# Altium schematic sheet ddc.schdoc: SoRad: Digital Down Converter
size C; Author: Chris Hiszpanski
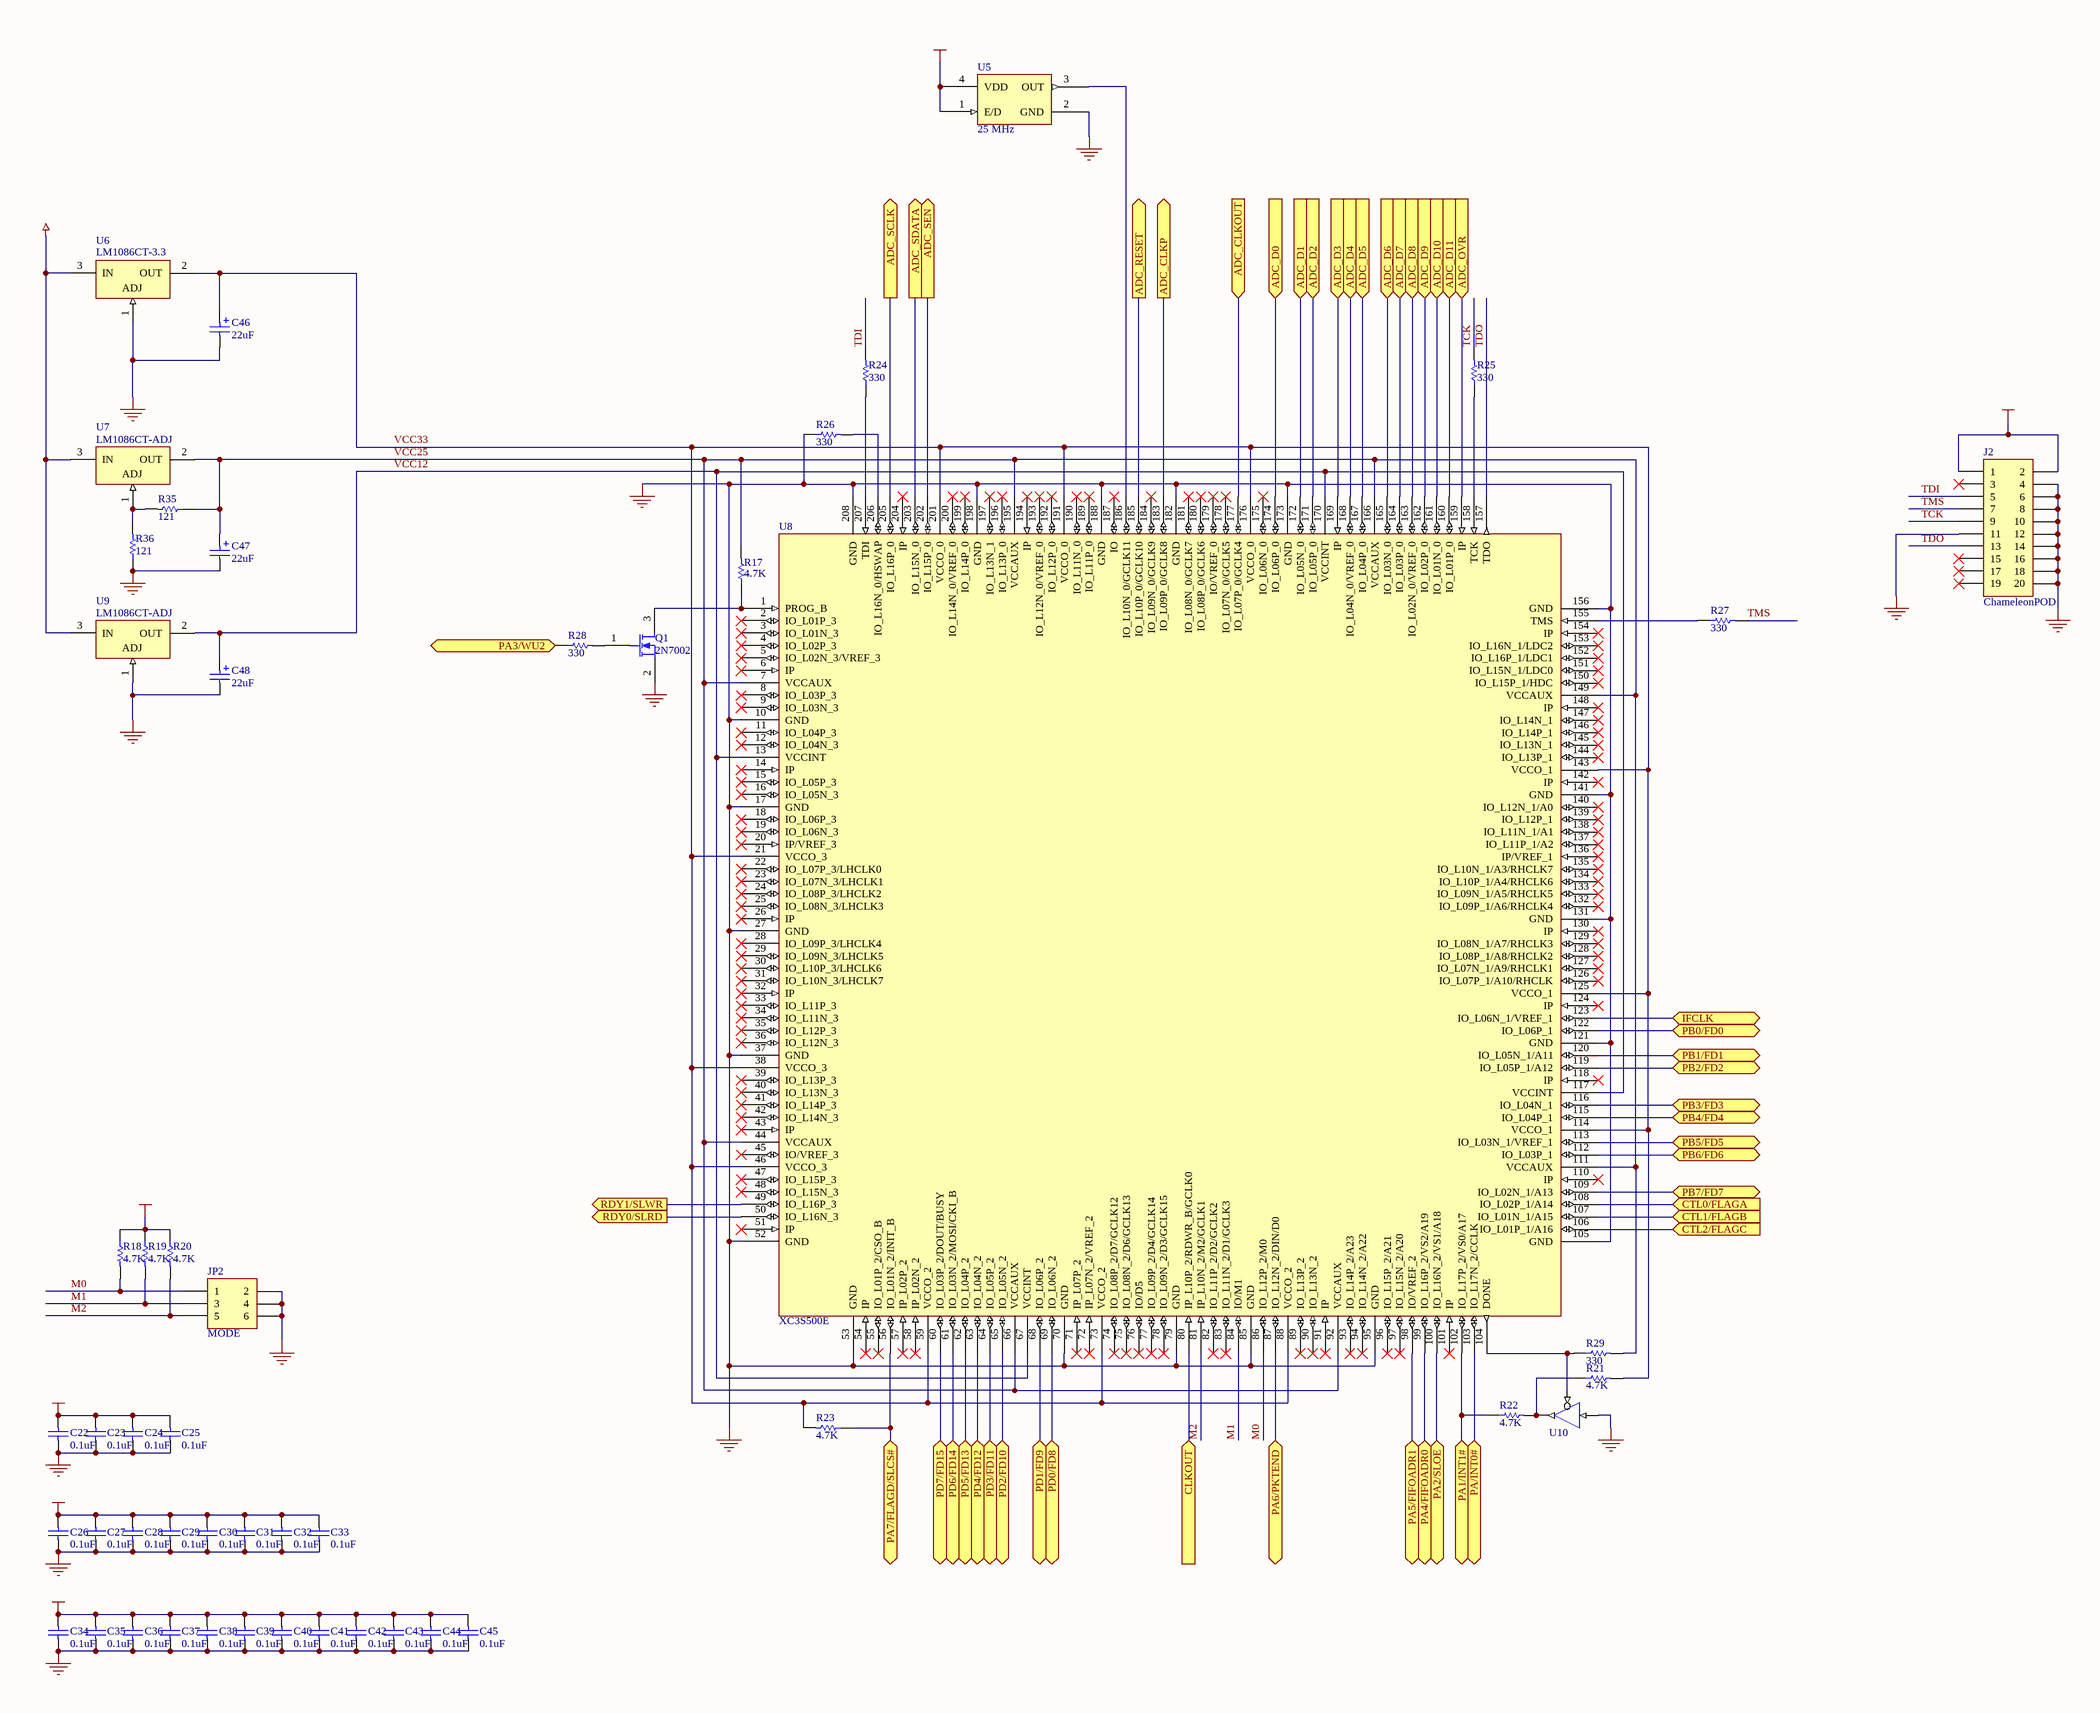
[diagram p0: ddc.schdoc]

## Parts
C22  0.1uF  [CC2012-0805]
C23  0.1uF  [CC2012-0805]
C24  0.1uF  [CC2012-0805]
C25  0.1uF  [CC2012-0805]
C26  0.1uF  [CC2012-0805]
C27  0.1uF  [CC2012-0805]
C28  0.1uF  [CC2012-0805]
C29  0.1uF  [CC2012-0805]
C30  0.1uF  [CC2012-0805]
C31  0.1uF  [CC2012-0805]
C32  0.1uF  [CC2012-0805]
C33  0.1uF  [CC2012-0805]
C34  0.1uF  [CC2012-0805]
C35  0.1uF  [CC2012-0805]
C36  0.1uF  [CC2012-0805]
C37  0.1uF  [CC2012-0805]
C38  0.1uF  [CC2012-0805]
C39  0.1uF  [CC2012-0805]
C40  0.1uF  [CC2012-0805]
C41  0.1uF  [CC2012-0805]
C42  0.1uF  [CC2012-0805]
C43  0.1uF  [CC2012-0805]
C44  0.1uF  [CC2012-0805]
C45  0.1uF  [CC2012-0805]
C46  22uF  [RB6.3]
C47  22uF  [RB6.3]
C48  22uF  [RB6.3]
J2  ChameleonPOD  [HDR2X10]
JP2  MODE  [HDR2X3]
Q1  2N7002  [SOT-23-3]
R17  4.7K  [CR2012-0805]
R18  4.7K  [CR2012-0805]
R19  4.7K  [CR2012-0805]
R20  4.7K  [CR2012-0805]
R21  4.7K  [CR2012-0805]
R22  4.7K  [CR2012-0805]
R23  4.7K  [CR2012-0805]
R24  330  [CR2012-0805]
R25  330  [CR2012-0805]
R26  330  [CR2012-0805]
R27  330  [CR2012-0805]
R28  330  [CR2012-0805]
R29  330  [CR2012-0805]
R35  121  [CC2012-0805]
R36  121  [CC2012-0805]
U5  25 MHz  [CSX750FB]
U6  LM1086CT-3.3  [SFM-T3/A4.7V]
U7  LM1086CT-ADJ  [SFM-T3/A4.7V]
U8  XC3S500E  [PQFP208]
U9  LM1086CT-ADJ  [SFM-T3/A4.7V]
U10  SN74AHC1G125  [SOT-23-6]  (value not drawn)

## Ports
ADC_CLKOUT (in), ADC_CLKP (out), ADC_D0 (in), ADC_D1 (in), ADC_D2 (in), ADC_D3 (in), ADC_D4 (in), ADC_D5 (in), ADC_D6 (in), ADC_D7 (in), ADC_D8 (in), ADC_D9 (in), ADC_D10 (in), ADC_D11 (in), ADC_OVR (in), ADC_RESET (out), ADC_SCLK (out), ADC_SDATA (out), ADC_SEN (out), CLKOUT (in), CTL0/FLAGA (in), CTL1/FLAGB (in), CTL2/FLAGC (in), IFCLK (bidir), PA1/INT1# (bidir), PA2/SLOE (bidir), PA3/WU2 (bidir), PA4/FIFOADR0 (bidir), PA5/FIFOADR1 (bidir), PA6/PKTEND (bidir), PA7/FLAGD/SLCS# (bidir), PA/INT0# (bidir), PB0/FD0 (bidir), PB1/FD1 (bidir), PB2/FD2 (bidir), PB3/FD3 (bidir), PB4/FD4 (bidir), PB5/FD5 (bidir), PB6/FD6 (bidir), PB7/FD7 (bidir), PD0/FD8 (bidir), PD1/FD9 (bidir), PD2/FD10 (bidir), PD3/FD11 (bidir), PD4/FD12 (bidir), PD5/FD13 (bidir), PD6/FD14 (bidir), PD7/FD15 (bidir), RDY0/SLRD (out), RDY1/SLWR (out)

## Nets
GND: C22.1 C23.1 C24.1 C25.1 C26.1 C27.1 C28.1 C29.1 C30.1 C31.1 C32.1 C33.1 C34.1 C35.1 C36.1 C37.1 C38.1 C39.1 C40.1 C41.1 C42.1 C43.1 C44.1 C45.1 C46.2 C47.2 C48.2 J2.4 J2.6 J2.8 J2.10 J2.11 J2.12 J2.14 J2.16 J2.18 J2.20 JP2.2 JP2.4 JP2.6 Q1.2(S) R26.1 R36.1 U5.2(GND) U6.1(ADJ) U8.10(GND) U8.17(GND) U8.27(GND) U8.37(GND) U8.52(GND) U8.53(GND) U8.70(GND) U8.79(GND) U8.85(GND) U8.95(GND) U8.105(GND) U8.121(GND) U8.131(GND) U8.141(GND) U8.156(GND) U8.173(GND) U8.182(GND) U8.188(GND) U8.198(GND) U8.208(GND) U9.1(ADJ) U10.2(A) U10.3(GND)
VCC5: U6.3(IN) U7.3(IN) U9.3(IN)
VCC12: C22.2 C23.2 C24.2 C25.2 C48.1 U8.13(VCCINT) U8.67(VCCINT) U8.117(VCCINT) U8.170(VCCINT) U9.2(OUT)
VCC25: C26.2 C27.2 C28.2 C29.2 C30.2 C31.2 C32.2 C33.2 C47.1 R17.2 R29.2 R35.1 U7.2(OUT) U8.7(VCCAUX) U8.44(VCCAUX) U8.66(VCCAUX) U8.92(VCCAUX) U8.111(VCCAUX) U8.149(VCCAUX) U8.166(VCCAUX) U8.195(VCCAUX)
VCC33: C34.2 C35.2 C36.2 C37.2 C38.2 C39.2 C40.2 C41.2 C42.2 C43.2 C44.2 C45.2 C46.1 J2.1 J2.2 R18.1 R19.1 R20.1 R21.2 R23.2 U5.1(E/D) U5.4(VDD) U6.2(OUT) U8.21(VCCO_3) U8.38(VCCO_3) U8.46(VCCO_3) U8.59(VCCO_2) U8.73(VCCO_2) U8.88(VCCO_2) U8.114(VCCO_1) U8.125(VCCO_1) U8.143(VCCO_1) U8.176(VCCO_0) U8.191(VCCO_0) U8.201(VCCO_0) U10.5(VCC)
ADC_CLKOUT: U8.177(IO_L07P_0/GCLK4) ; port ADC_CLKOUT
ADC_CLKP: U8.183(IO_L09P_0/GCLK8) ; port ADC_CLKP
ADC_D0: U8.174(IO_L06P_0) ; port ADC_D0
ADC_D1: U8.172(IO_L05N_0) ; port ADC_D1
ADC_D2: U8.171(IO_L05P_0) ; port ADC_D2
ADC_D3: U8.169(IP) ; port ADC_D3
ADC_D4: U8.168(IO_L04N_0/VREF_0) ; port ADC_D4
ADC_D5: U8.167(IO_L04P_0) ; port ADC_D5
ADC_D6: U8.165(IO_L03N_0) ; port ADC_D6
ADC_D7: U8.164(IO_L03P_0) ; port ADC_D7
ADC_D8: U8.163(IO_L02N_0/VREF_0) ; port ADC_D8
ADC_D9: U8.162(IO_L02P_0) ; port ADC_D9
ADC_D10: U8.161(IO_L01N_0) ; port ADC_D10
ADC_D11: U8.160(IO_L01P_0) ; port ADC_D11
ADC_OVR: U8.159(IP) ; port ADC_OVR
ADC_RESET: U8.185(IO_L10P_0/GCLK10) ; port ADC_RESET
ADC_SCLK: U8.205(IO_L16P_0) ; port ADC_SCLK
ADC_SDATA: U8.203(IO_L15N_0) ; port ADC_SDATA
ADC_SEN: U8.202(IO_L15P_0) ; port ADC_SEN
CLKOUT: U8.80(IP_L10P_2/RDWR_B/GCLK0) ; port CLKOUT
CTL0/FLAGA: U8.108(IO_L02P_1/A14) ; port CTL0/FLAGA
CTL1/FLAGB: U8.107(IO_L01N_1/A15) ; port CTL1/FLAGB
CTL2/FLAGC: U8.106(IO_L01P_1/A16) ; port CTL2/FLAGC
IFCLK: U8.123(IO_L06N_1/VREF_1) ; port IFCLK
M0: JP2.1 R18.2 U8.86(IO_L12P_2/M0)
M1: JP2.3 R19.2 U8.84(IO/M1)
M2: JP2.5 R20.2 U8.81(IP_L10N_2/M2/GCLK1)
PA1/INT1#: R22.1 U8.102(IO_L17P_2/VS0/A17) ; port PA1/INT1#
PA2/SLOE: U8.100(IO_L16N_2/VS1/A18) ; port PA2/SLOE
PA3/WU2: R28.1 ; port PA3/WU2
PA4/FIFOADR0: U8.99(IO_L16P_2/VS2/A19) ; port PA4/FIFOADR0
PA5/FIFOADR1: U8.98(IO/VREF_2) ; port PA5/FIFOADR1
PA6/PKTEND: U8.87(IO_L12N_2/DIN/D0) ; port PA6/PKTEND
PA7/FLAGD/SLCS#: R23.1 U8.56(IO_L01N_2/INIT_B) ; port PA7/FLAGD/SLCS#
PA/INT0#: U8.103(IO_L17N_2/CCLK) ; port PA/INT0#
PB0/FD0: U8.122(IO_L06P_1) ; port PB0/FD0
PB1/FD1: U8.120(IO_L05N_1/A11) ; port PB1/FD1
PB2/FD2: U8.119(IO_L05P_1/A12) ; port PB2/FD2
PB3/FD3: U8.116(IO_L04N_1) ; port PB3/FD3
PB4/FD4: U8.115(IO_L04P_1) ; port PB4/FD4
PB5/FD5: U8.113(IO_L03N_1/VREF_1) ; port PB5/FD5
PB6/FD6: U8.112(IO_L03P_1) ; port PB6/FD6
PB7/FD7: U8.109(IO_L02N_1/A13) ; port PB7/FD7
PD0/FD8: U8.69(IO_L06N_2) ; port PD0/FD8
PD1/FD9: U8.68(IO_L06P_2) ; port PD1/FD9
PD2/FD10: U8.65(IO_L05N_2) ; port PD2/FD10
PD3/FD11: U8.64(IO_L05P_2) ; port PD3/FD11
PD4/FD12: U8.63(IO_L04N_2) ; port PD4/FD12
PD5/FD13: U8.62(IO_L04P_2) ; port PD5/FD13
PD6/FD14: U8.61(IO_L03N_2/MOSI/CKI_B) ; port PD6/FD14
PD7/FD15: U8.60(IO_L03P_2/DOUT/BUSY) ; port PD7/FD15
RDY0/SLRD: U8.50(IO_L16N_3) ; port RDY0/SLRD
RDY1/SLWR: U8.49(IO_L16P_3) ; port RDY1/SLWR
TCK: J2.9 R25.2
TDI: J2.5 R24.2
TDO: J2.13 U8.157(TDO)
TMS: J2.7 R27.2
NetQ1_1: Q1.1(G) R28.2
NetQ1_3: Q1.3(D) R17.1 U8.1(PROG_B)
NetR21_1: R21.1 R22.2 U10.4(Y)
NetR24_1: R24.1 U8.207(TDI)
NetR25_1: R25.1 U8.158(TCK)
NetR26_2: R26.2 U8.206(IO_L16N_0/HSWAP)
NetR27_1: R27.1 U8.155(TMS)
NetR29_1: R29.1 U8.104(DONE) U10.1(/OE)
NetR35_2: R35.2 R36.2 U7.1(ADJ)
NetU5_3: U5.3(OUT) U8.186(IO_L10N_0/GCLK11)

Not connected (* = marked no-connect by the designer): J2 3* 15* 17* 19*; U8 2(IO_L01P_3)* 3(IO_L01N_3)* 4(IO_L02P_3)* 5(IO_L02N_3/VREF_3)* 6(IP)* 8(IO_L03P_3)* 9(IO_L03N_3)* 11(IO_L04P_3)* 12(IO_L04N_3)* 14(IP)* 15(IO_L05P_3)* 16(IO_L05N_3)* 18(IO_L06P_3)* 19(IO_L06N_3)* 20(IP/VREF_3)* 22(IO_L07P_3/LHCLK0)* 23(IO_L07N_3/LHCLK1)* 24(IO_L08P_3/LHCLK2)* 25(IO_L08N_3/LHCLK3)* 26(IP)* 28(IO_L09P_3/LHCLK4)* 29(IO_L09N_3/LHCLK5)* 30(IO_L10P_3/LHCLK6)* 31(IO_L10N_3/LHCLK7)* 32(IP)* 33(IO_L11P_3)* 34(IO_L11N_3)* 35(IO_L12P_3)* 36(IO_L12N_3)* 39(IO_L13P_3)* 40(IO_L13N_3)* 41(IO_L14P_3)* 42(IO_L14N_3)* 43(IP)* 45(IO/VREF_3)* 47(IO_L15P_3)* 48(IO_L15N_3)* 51(IP)* 54(IP)* 55(IO_L01P_2/CSO_B)* 57(IP_L02P_2)* 58(IP_L02N_2)* 71(IP_L07P_2)* 72(IP_L07N_2/VREF_2)* 74(IO_L08P_2/D7/GCLK12)* 75(IO_L08N_2/D6/GCLK13)* 76(IO/D5)* 77(IO_L09P_2/D4/GCLK14)* 78(IO_L09N_2/D3/GCLK15)* 82(IO_L11P_2/D2/GCLK2)* 83(IO_L11N_2/D1/GCLK3)* 89(IO_L13P_2)* 90(IO_L13N_2)* 91(IP)* 93(IO_L14P_2/A23)* 94(IO_L14N_2/A22)* 96(IO_L15P_2/A21)* 97(IO_L15N_2/A20)* 101(IP)* 110(IP)* 118(IP)* 124(IP)* 126(IO_L07P_1/A10/RHCLK)* 127(IO_L07N_1/A9/RHCLK1)* 128(IO_L08P_1/A8/RHCLK2)* 129(IO_L08N_1/A7/RHCLK3)* 130(IP)* 132(IO_L09P_1/A6/RHCLK4)* 133(IO_L09N_1/A5/RHCLK5)* 134(IO_L10P_1/A4/RHCLK6)* 135(IO_L10N_1/A3/RHCLK7)* 136(IP/VREF_1)* 137(IO_L11P_1/A2)* 138(IO_L11N_1/A1)* 139(IO_L12P_1)* 140(IO_L12N_1/A0)* 142(IP)* 144(IO_L13P_1)* 145(IO_L13N_1)* 146(IO_L14P_1)* 147(IO_L14N_1)* 148(IP)* 150(IO_L15P_1/HDC)* 151(IO_L15N_1/LDC0)* 152(IO_L16P_1/LDC1)* 153(IO_L16N_1/LDC2)* 154(IP)* 175(IO_L06N_0)* 178(IO_L07N_0/GCLK5)* 179(IO/VREF_0)* 180(IO_L08P_0/GCLK6)* 181(IO_L08N_0/GCLK7)* 184(IO_L09N_0/GCLK9)* 187(IO)* 189(IO_L11P_0)* 190(IO_L11N_0)* 192(IO_L12P_0)* 193(IO_L12N_0/VREF_0)* 194(IP)* 196(IO_L13P_0)* 197(IO_L13N_1)* 199(IO_L14P_0)* 200(IO_L14N_0/VREF_0)* 204(IP)*

## Library data of the parts
C22-C45 = Cap: Capacitor; Manufacturer: Panasonic; Manufacturer Part Number: ECJ-2VF1C104Z; Published: 8-Jun-2000; Revision: July-2002: Re-released for DXP Platform.; Publisher: Altium Limited; Value: 0.1uF; Distributor: Digikey; Distributor Part Number: PCC1843CT-ND
C46-C48 = Cap Pol1: Polarized Capacitor (Radial); Manufacturer: Panasonic; Manufacturer Part Number: ECE-A1HKA220; Published: 8-Jun-2000; Revision: July-2002: Re-released for DXP Platform.; Publisher: Altium Limited; Value: 22uF; Distributor: Digikey; Distributor Part Number: P837-ND
J2 = Header 10X2: Header, 10-Pin, Dual row; Manufacturer: 3M; Manufacturer Part Number: 2520-6002UB; Class I: Connector; Revision: July-2002: Re-released for DXP Platform.; Publisher: Altium Limited; Distributor: Digikey; Distributor Part Number: MHB20K-ND
JP2 = Header 3X2: Header, 3-Pin, Dual row; Manufacturer: Generic Components; Manufacturer: NA; Class I: Connector; Revision: July-2002: Re-released for DXP Platform.; Publisher: Altium Limited; Distributor: Stockroom; Distributor Part Number: NA; Manufacturer Part Number: NA
Q1 = MOSFET-N: N-Channel MOSFET; Manufacturer: ST Microelectronics; Class I: Discrete; Class II: MOSFET - Low Power; Published: 8-Jun-2000; Revision: July-2002: Re-released for DXP Platform.; Publisher: Altium Limited; Distributor: Digikey; Distributor Part Number: 497-3111-1-ND; Manufacturer Part Number: 2N7002
R17-R23 = Res1: Resistor; Manufacturer: Generic Components; Manufacturer: Vishay/Dale; Manufacturer Part Number: CRCW08054K70JNEA; Class I: Passive; Published: 8-Jun-2000; Revision: July-2002: Re-released for DXP Platform.; Publisher: Altium Limited; Class II: Resistor; Value: 4.7K; Distributor: Digikey; Distributor Part Number: 541-4.7KACT-ND
R24-R29 = Res1: Resistor; Manufacturer: Generic Components; Manufacturer: Panasonic; Manufacturer Part Number: ERJ-6GEYJ331V; Class I: Passive; Published: 8-Jun-2000; Revision: July-2002: Re-released for DXP Platform.; Publisher: Altium Limited; Class II: Resistor; Value: 330; Distributor: Digikey; Distributor Part Number: P330ACT-ND
R35 R36 = Res1: Resistor; Manufacturer: Generic Components; Class I: Passive; Published: 8-Jun-2000; Revision: July-2002: Re-released for DXP Platform.; Publisher: Altium Limited; Class II: Resistor; Value: 121
U5 = CWX815-100.0M: Part No.: 300-7246-1-ND; Manufacturer: Citizen America; Manufacturer Part Number: CSX750FBC25.000000M-UT; Distributor: Digikey
U6 = LM317HVT: 3-Terminal Adjustable Regulator; Manufacturer: National Semiconductor; Manufacturer Part Number: LM1086CT-3.3/NOPB; Class I: Power Management; Class II: Voltage Regulator; Note: Tab is connected to Output; Datasheet: Latest Revision: May-1999; Package Reference: T03B; Distributor: Digikey; Distributor Part Number: LM1086CT-3.3-ND
U7 U9 = LM317HVT: 3-Terminal Adjustable Regulator; Manufacturer: National Semiconductor; Manufacturer Part Number: LM1086CT-ADJ/NOPB; Package Information: Latest Revision: 1995; Class I: Power Management; Class II: Voltage Regulator; Note: Tab is connected to Output; Published: 15-Apr-2002; Datasheet: Latest Revision: May-1999; Package Reference: T03B; Publisher: Altium Limited; Distributor: Digikey; Distributor Part Number: LM1086CT-ADJ-ND
U8 = XC3S500E: Xilinx Spartan-3E FPGA; Manufacturer Part Number: XC3S500E-4PQG208C; Distributor: Digikey; Distributor Part Number: 122-1520-ND; Manufacturer: Xilinx
U10 = SN74AHC1G125: Single 3-state buffer; Manufacturer: Texas Instruments; Manufacturer Part Number: SN74AHC1G125DBVR; Distributor: Digikey; Distributor Part Number: 296-8744-1-ND